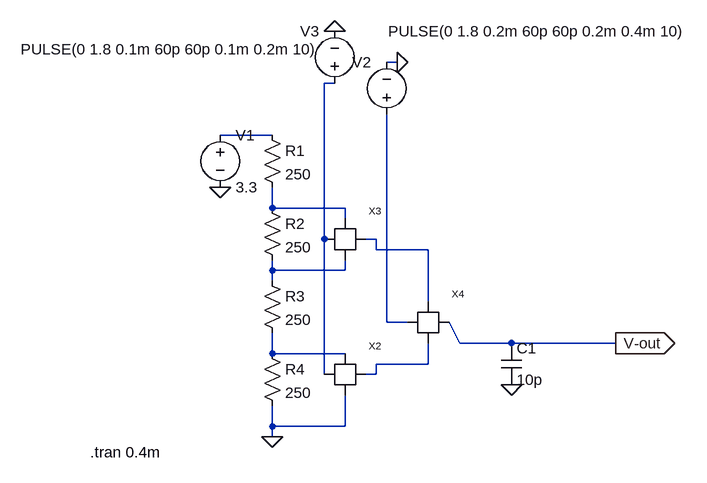
[diagram p0: schematic 2_bit_dac.asc]
2_bit_dac.asc, the LTspice schematic file:
Version 4
SHEET 1 1160 680
WIRE 448 -64 432 -64
WIRE 352 -32 336 -32
WIRE 256 48 176 48
WIRE 256 160 256 128
WIRE 368 160 256 160
WIRE 368 176 368 160
WIRE 336 208 336 -32
WIRE 416 208 400 208
WIRE 416 224 416 208
WIRE 496 224 416 224
WIRE 256 256 256 240
WIRE 368 256 368 240
WIRE 368 256 256 256
WIRE 256 272 256 256
WIRE 496 304 496 224
WIRE 432 336 432 16
WIRE 464 336 432 336
WIRE 544 368 528 336
WIRE 624 368 544 368
WIRE 784 368 624 368
WIRE 256 384 256 352
WIRE 368 384 256 384
WIRE 496 400 496 368
WIRE 496 400 416 400
WIRE 336 416 336 208
WIRE 416 416 416 400
WIRE 416 416 400 416
WIRE 256 496 256 464
WIRE 368 496 368 448
WIRE 368 496 256 496
WIRE 256 512 256 496
FLAG 256 512 0
FLAG 176 128 0
FLAG 352 -112 0
FLAG 448 -64 0
FLAG 784 368 V-out
IOPIN 784 368 Out
FLAG 624 432 0
SYMBOL voltage 176 32 R0
WINDOW 123 0 0 Left 0
WINDOW 39 0 0 Left 0
SYMATTR InstName V1
SYMATTR Value 3.3
SYMBOL res 240 32 R0
SYMATTR InstName R1
SYMATTR Value 250
SYMBOL res 240 144 R0
SYMATTR InstName R2
SYMATTR Value 250
SYMBOL res 240 256 R0
SYMATTR InstName R3
SYMATTR Value 250
SYMBOL voltage 432 32 R180
WINDOW 0 24 96 Left 2
WINDOW 3 -461 144 Left 2
WINDOW 123 0 0 Left 0
WINDOW 39 0 0 Left 0
SYMATTR InstName V2
SYMATTR Value PULSE(0 1.8 0.2m 60p 60p 0.2m 0.4m 10)
SYMBOL voltage 352 -16 R180
WINDOW 0 24 96 Left 2
WINDOW 3 24 68 Left 2
WINDOW 123 0 0 Left 0
WINDOW 39 0 0 Left 0
SYMATTR InstName V3
SYMATTR Value PULSE(0 1.8 0.1m 60p 60p 0.1m 0.2m 10)
SYMBOL switch 368 416 R0
SYMATTR InstName X2
SYMBOL switch 368 208 R0
SYMATTR InstName X3
SYMBOL switch 496 336 R0
SYMATTR InstName X4
SYMBOL res 240 368 R0
SYMATTR InstName R4
SYMATTR Value 250
SYMBOL cap 608 368 R0
SYMATTR InstName C1
SYMATTR Value 10p
TEXT -24 536 Left 2 !.tran 0.4m

The netlist it stands for:
* 2_bit_dac.asc
V1 N002 0 3.3
R1 N002 N003 250
R2 N003 N005 250
R3 N005 N007 250
V2 N006 0 PULSE(0 1.8 0.2m 60p 60p 0.2m 0.4m 10)
V3 N001 0 PULSE(0 1.8 0.1m 60p 60p 0.1m 0.2m 10)
XX2 N001 N007 0 N008 switch  ; pins digital_input Vin_1 Vin_2 Vout
XX3 N001 N003 N005 N004 switch  ; pins digital_input Vin_1 Vin_2 Vout
XX4 N006 N004 N008 V-out switch  ; pins digital_input Vin_1 Vin_2 Vout
R4 N007 0 250
C1 V-out 0 10p
.tran 0.4m
.backanno
.end